# EAGLE schematic power mux (EAGLE 6.5.0)
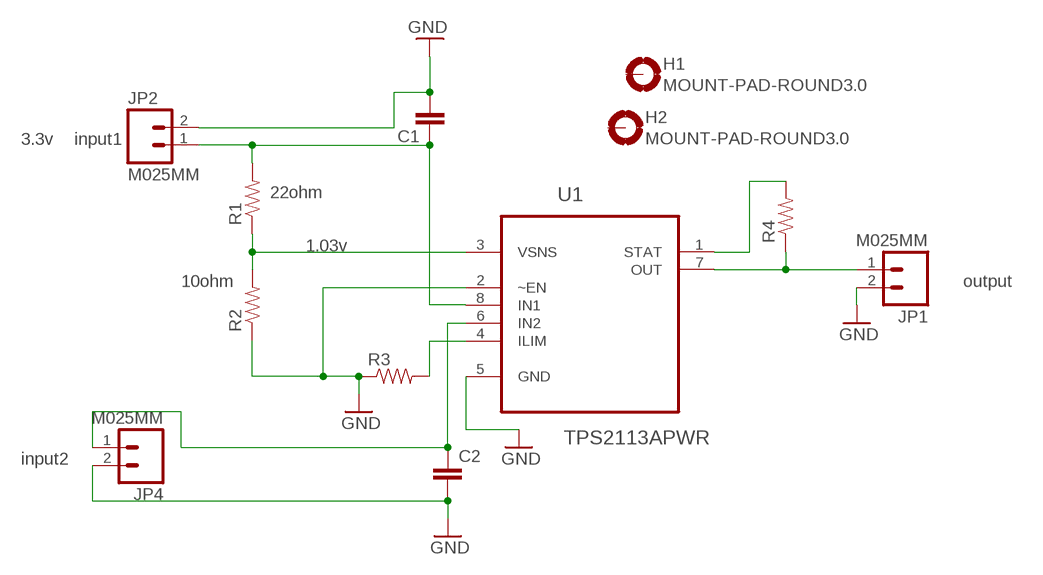
[diagram p0: schematic, sheet 1]

## Parts
C1  CAP0805  [0805]
C2  CAP0805  [0805]
H1  MOUNT-PAD-ROUND3.0  [3,0-PAD]
H2  MOUNT-PAD-ROUND3.0  [3,0-PAD]
JP1  M025MM  [SCREWTERMINAL-5MM-2]
JP2  M025MM  [SCREWTERMINAL-5MM-2]
JP4  M025MM  [SCREWTERMINAL-5MM-2]
R1  RESISTORPTH-1/4W-VERT  [AXIAL-0.1]
R2  RESISTORPTH-1/4W-VERT  [AXIAL-0.1]
R3  RESISTORPTH-1/4W-VERT  [AXIAL-0.1]
R4  RESISTORPTH-1/4W-VERT  [AXIAL-0.1]
U1  TPS2113APWR  [SOP65P640X120-8N]

## Nets
GND: C1.2 C2.2 JP1.2 JP2.2 JP4.2 U1.5(GND)
GND6: R2.P$1 R3.P$1 U1.2(~EN) ; supply symbol labelled GND
ILIM: R3.P$2 U1.4(ILIM)
IN1+: C1.1 JP2.1 R1.P$2 U1.8(IN1)
IN2+: C2.1 JP4.1 U1.6(IN2)
N$8: R4.P$2 U1.1(STAT)
OUT: JP1.1 R4.P$1 U1.7(OUT)
VSENS: R1.P$1 R2.P$2 U1.3(VSNS)
Unconnected: H1.B3,0(MOUNT) H2.B3,0(MOUNT)

## Notes on the sheet
- 3.3v | input1
- 22ohm
- 1.03v
- 10ohm | output
- input2

## Library data of the parts
C1 C2 = SparkFun-Capacitors:CAP: Capacitor Standard 0603 ceramic capacitor, and 0.1" leaded capacitor.
H1 H2 = holes:MOUNT-PAD-ROUND: MOUNTING PAD, round
JP1 JP2 JP4 = SparkFun-Connectors:M02: Standard 2-pin 0.1" header. Use with - straight break away headers ( PRT-00116) - right angle break away headers (PRT-00553) - swiss pins (PRT-00743) - machine pins (PRT-00117) - female headers (PRT-00115) Molex polarized connector foot print use with: PRT-08233 with associated crimp pins and housings. 2.54_SCREWTERM for use with PRT-10571. 3.5mm Screw Terminal footprints for PRT-08084 5mm Screw Terminal footprints for use with PRT-08433
R1-R4 = SparkFun-Resistors:RESISTOR: Resistor Basic schematic elements and footprints for 0603, 1206, and PTH resistors.
U1 = Texas Instruments_By_element14_Batch_1:TPS2113APWR: AUTOSWITCHING POWER MUX; MPN: TPS2113APWR; OC_FARNELL: 1757288; OC_NEWARK: 01J0961; PACKAGE: TSSOP-8; SUPPLIER: TEXAS INSTRUMENTS